# Altium schematic sheet IO.SchDoc
size A3
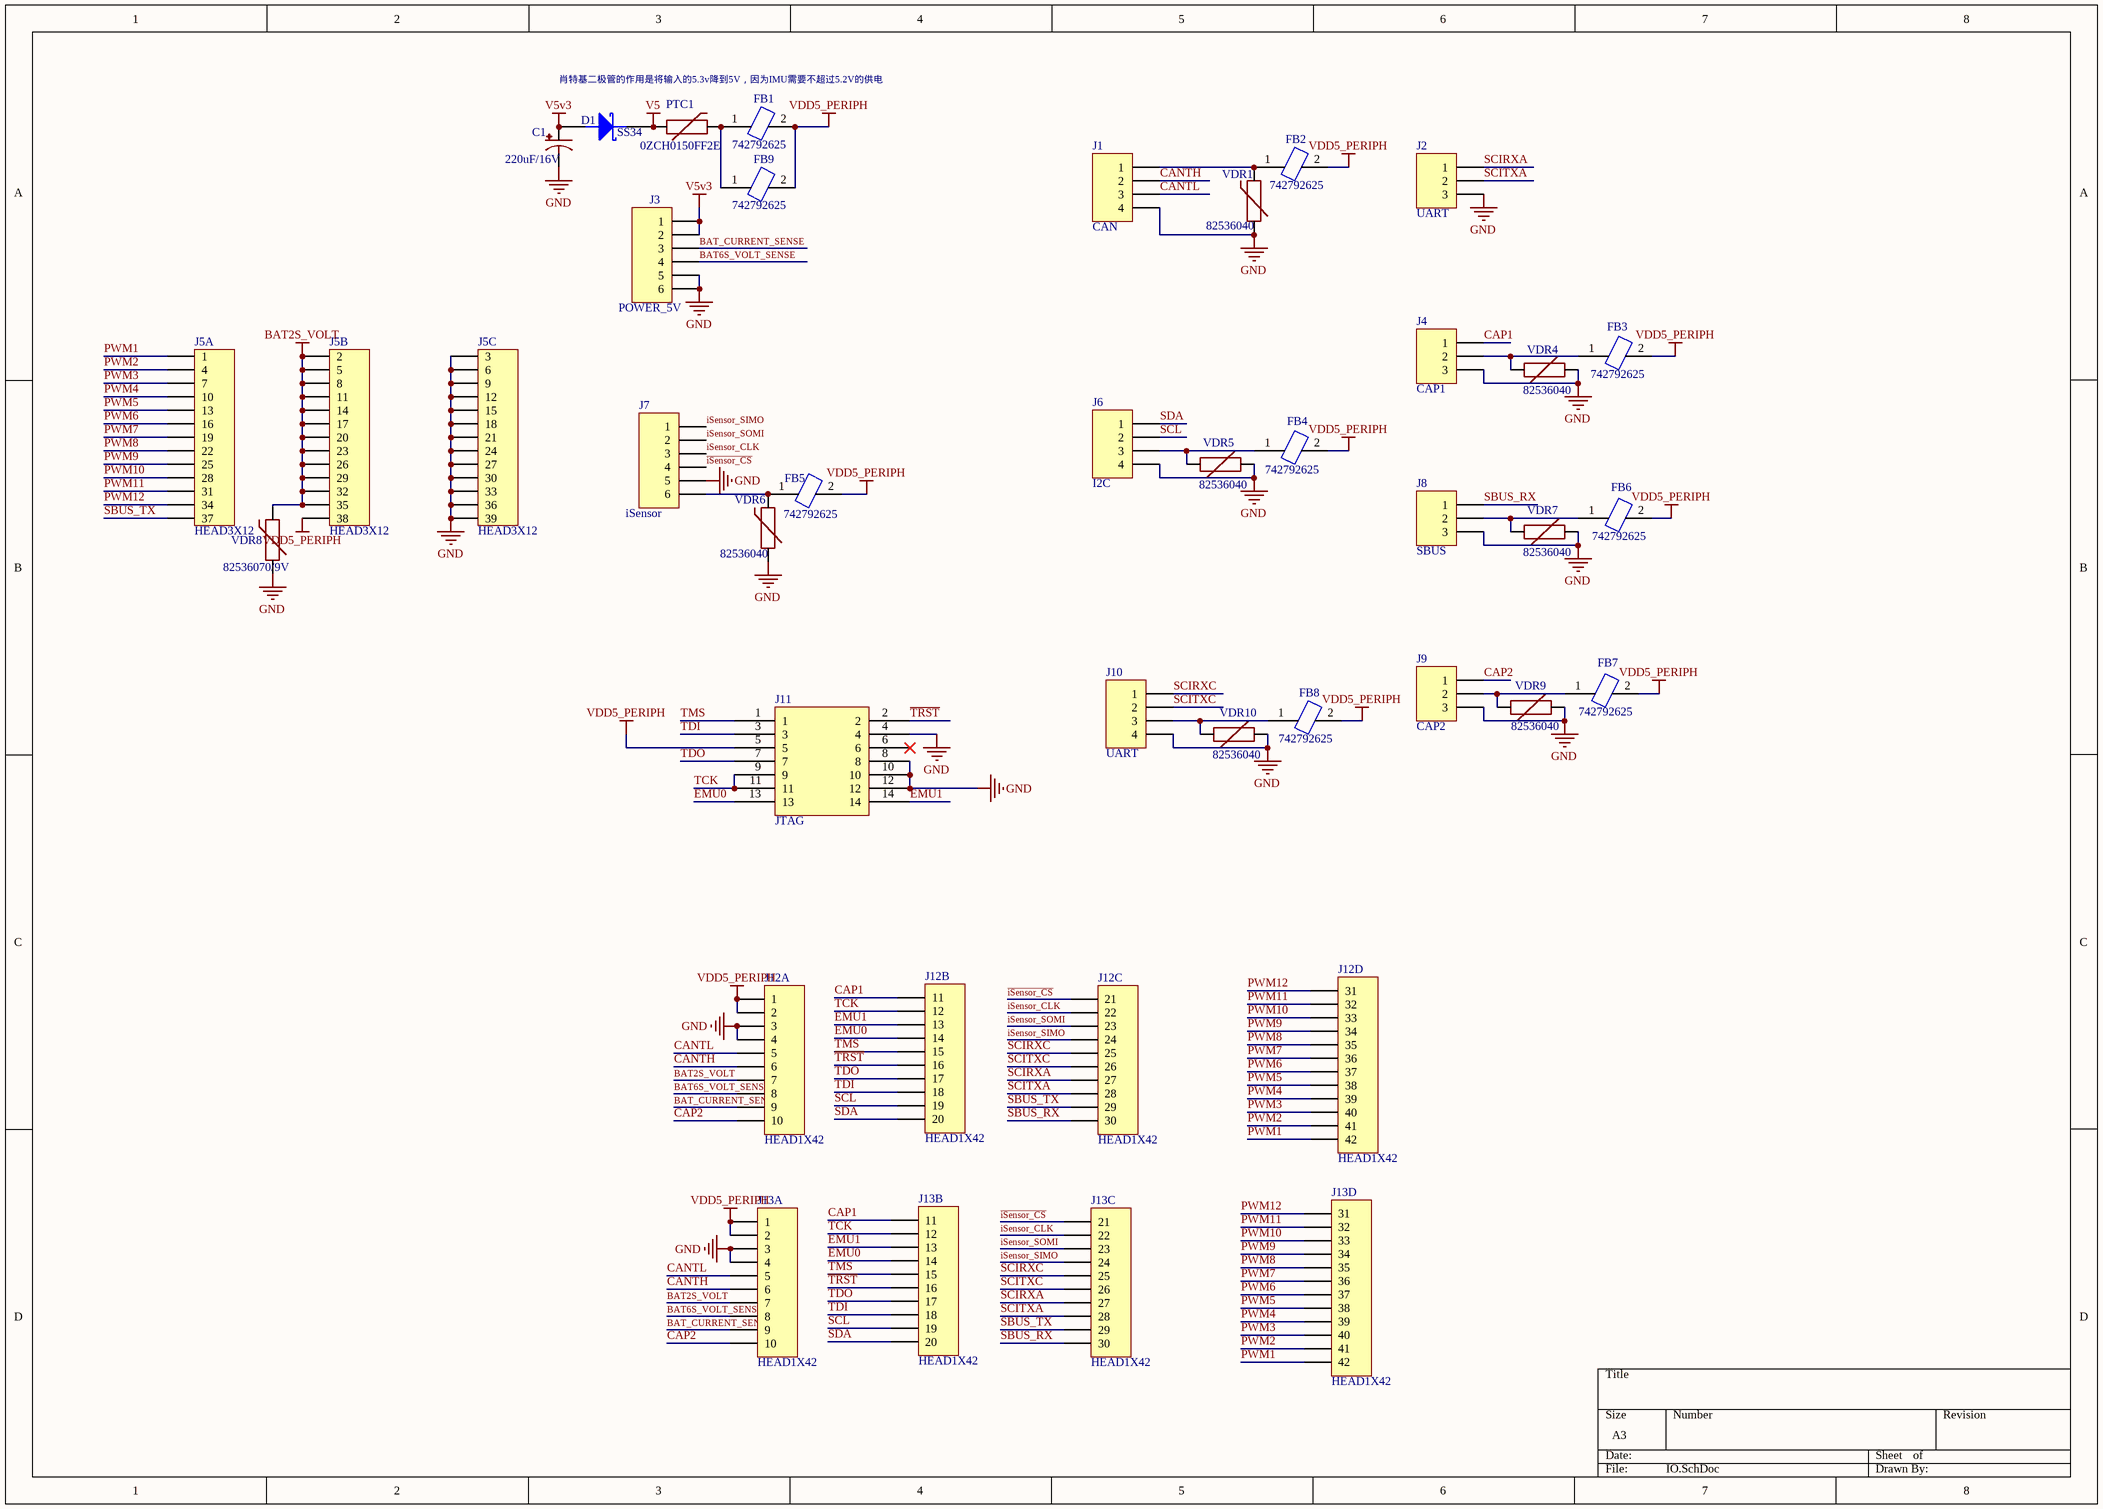
[diagram p0: IO.SchDoc]

## Parts
C1  220uF/16V  [6.3*7.7/H/220u]
D1  SS34  [SMB/DO-214AA]
FB1  742792625  [0603-FB]
FB2  742792625  [0603-FB]
FB3  742792625  [0603-FB]
FB4  742792625  [0603-FB]
FB5  742792625  [0603-FB]
FB6  742792625  [0603-FB]
FB7  742792625  [0603-FB]
FB8  742792625  [0603-FB]
FB9  742792625  [0603-FB]
J1  CAN  [GH1.25-4]
J2  UART  [SIP3]
J3  POWER_5V  [GH1.25-6]
J4  CAP1  [SIP3]
J5  HEAD3X12  [3X13RA]  (parts A,B,C of 4)
J6  I2C  [GH1.25-4]
J7  iSensor  [GH1.25-6]
J8  SBUS  [SIP3]
J9  CAP2  [SIP3]
J10  UART  [GH1.25-4]
J11  JTAG  [IDC14-SMT]
J12  HEAD1X42  [FPC0.5-42]  (parts A,B,C,D of 4)
J13  HEAD1X42  [FPC0.5-42]  (parts A,B,C,D of 4)
PTC1  0ZCH0150FF2E  [1210]
VDR1  82536040  [0603R]
VDR4  82536040  [0603R]
VDR5  82536040  [0603R]
VDR6  82536040  [0603R]
VDR7  82536040  [0603R]
VDR8  82536070/9V  [0603R]
VDR9  82536040  [0603R]
VDR10  82536040  [0603R]

## Nets
BAT2S_VOLT: J5.2 J5.5 J5.8 J5.11 J5.14 J5.17 J5.20 J5.23 J5.26 J5.29 J5.32 J5.35 J12.7 J13.7 VDR8.2
GND: C1.2 J1.4 J2.3 J3.5 J3.6 J4.3 J5.3 J5.6 J5.9 J5.12 J5.15 J5.18 J5.21 J5.24 J5.27 J5.30 J5.33 J5.36 J5.39 J6.4 J7.5 J8.3 J9.3 J10.4 J11.4 J11.8 J11.10 J11.12 J12.3 J12.4 J13.3 J13.4 VDR1.1 VDR4.2 VDR5.1 VDR6.1 VDR7.1 VDR8.1 VDR9.1 VDR10.1
V5: D1.2 PTC1.1
V5v3: C1.1 D1.1 J3.1 J3.2
VDD5_PERIPH: FB1.2 FB2.2 FB3.2 FB4.2 FB5.2 FB6.2 FB7.2 FB8.2 FB9.2 J5.38 J11.5 J12.1 J12.2 J13.1 J13.2
BAT6S_VOLT_SENSE: J3.4 J12.8 J13.8
BAT_CURRENT_SENSE: J3.3 J12.9 J13.9
CANTH: J1.2 J12.6 J13.6
CANTL: J1.3 J12.5 J13.5
CAP1: J4.1 J12.11 J13.11
CAP2: J9.1 J12.10 J13.10
EMU0: J11.13 J12.14 J13.14
EMU1: J11.14 J12.13 J13.13
~{iSensor_CS}: J7.4 J12.21 J13.21
iSensor_CLK: J7.3 J12.22 J13.22
iSensor_SIMO: J7.1 J12.24 J13.24
iSensor_SOMI: J7.2 J12.23 J13.23
PWM1: J5.1 J12.42 J13.42
PWM2: J5.4 J12.41 J13.41
PWM3: J5.7 J12.40 J13.40
PWM4: J5.10 J12.39 J13.39
PWM5: J5.13 J12.38 J13.38
PWM6: J5.16 J12.37 J13.37
PWM7: J5.19 J12.36 J13.36
PWM8: J5.22 J12.35 J13.35
PWM9: J5.25 J12.34 J13.34
PWM10: J5.28 J12.33 J13.33
PWM11: J5.31 J12.32 J13.32
PWM12: J5.34 J12.31 J13.31
SBUS_RX: J8.1 J12.30 J13.30
SBUS_TX: J5.37 J12.29 J13.29
SCIRXA: J2.1 J12.27 J13.27
SCIRXC: J10.1 J12.25 J13.25
SCITXA: J2.2 J12.28 J13.28
SCITXC: J10.2 J12.26 J13.26
SCL: J6.2 J12.19 J13.19
SDA: J6.1 J12.20 J13.20
~{TRST}: J11.2 J12.16 J13.16
TCK: J11.9 J11.11 J12.12 J13.12
TDI: J11.3 J12.18 J13.18
TDO: J11.7 J12.17 J13.17
TMS: J11.1 J12.15 J13.15
NetFB1_1: FB1.1 FB9.1 PTC1.2
NetFB2_1: FB2.1 J1.1 VDR1.2
NetFB3_1: FB3.1 J4.2 VDR4.1
NetFB4_1: FB4.1 J6.3 VDR5.2
NetFB5_1: FB5.1 J7.6 VDR6.2
NetFB6_1: FB6.1 J8.2 VDR7.2
NetFB7_1: FB7.1 J9.2 VDR9.2
NetFB8_1: FB8.1 J10.3 VDR10.2

Not connected (* = marked no-connect by the designer): J11 6*

## Notes on the sheet
- 肖特基二极管的作用是将输入的5.3v降到5V，因为IMU需要不超过5.2V的供电

## Library data of the parts
C1 = C-POLAR
D1 = DIODE SCHOTTKY
FB1-FB9 = FB
J1 J6 J10 = HEAD1X4
J2 J4 J8 J9 = HEAD1X3
J3 J7 = HEAD1X6
J11 = IDC-14
PTC1 = PTC
VDR1 VDR4-VDR10 = Varistor